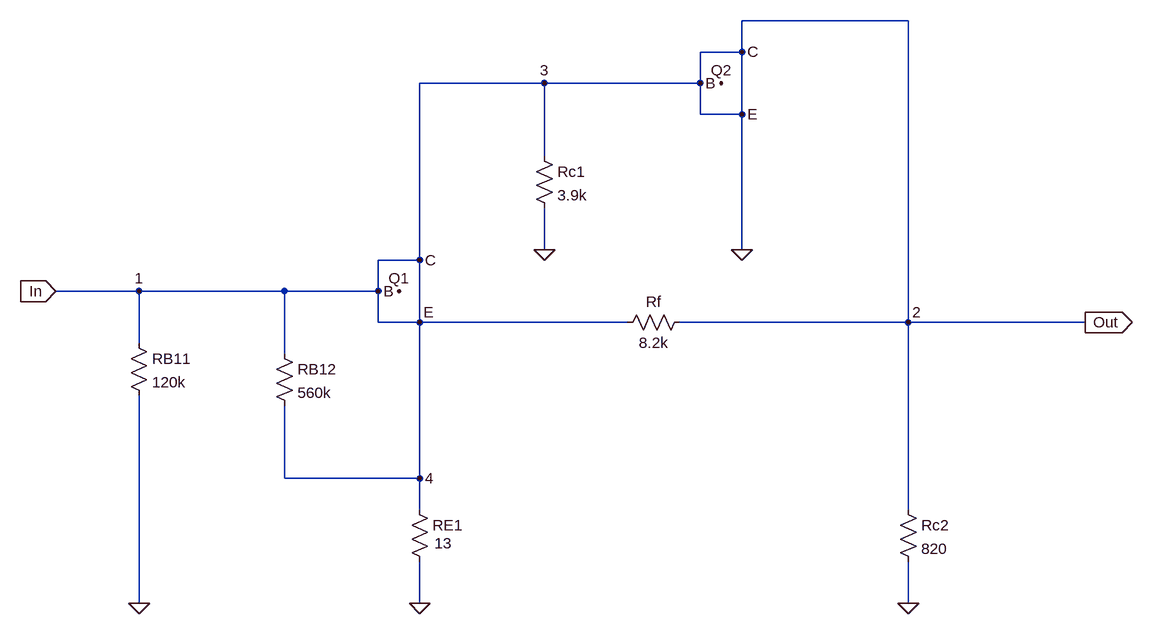
[diagram p0: schematic AC_equivalent_circuit.asc]
AC_equivalent_circuit.asc, the LTspice schematic file:
Version 4
SHEET 1 1652 680
WIRE 1280 -352 1024 -352
WIRE 1024 -304 1024 -352
WIRE 1024 -304 960 -304
WIRE 720 -256 528 -256
WIRE 960 -256 960 -304
WIRE 960 -256 720 -256
WIRE 960 -208 960 -256
WIRE 1024 -208 1024 -304
WIRE 1024 -208 960 -208
WIRE 720 -144 720 -256
WIRE 720 0 720 -64
WIRE 1024 0 1024 -208
WIRE 528 16 528 -256
WIRE 528 16 464 16
WIRE 96 64 -32 64
WIRE 320 64 96 64
WIRE 464 64 464 16
WIRE 464 64 320 64
WIRE 464 112 464 64
WIRE 528 112 528 16
WIRE 528 112 464 112
WIRE 848 112 528 112
WIRE 1280 112 1280 -352
WIRE 1280 112 928 112
WIRE 1552 112 1280 112
WIRE 96 144 96 64
WIRE 320 160 320 64
WIRE 320 352 320 240
WIRE 528 352 528 112
WIRE 528 352 320 352
WIRE 528 400 528 352
WIRE 1280 400 1280 112
WIRE 96 544 96 224
WIRE 528 544 528 480
WIRE 1280 544 1280 480
FLAG 1552 112 Out
IOPIN 1552 112 Out
FLAG -32 64 In
IOPIN -32 64 In
FLAG 96 64 1
FLAG 96 544 0
FLAG 1280 544 0
FLAG 720 0 0
FLAG 528 544 0
FLAG 1280 112 2
FLAG 720 -256 3
FLAG 528 352 4
FLAG 1024 0 0
FLAG 496 64 Q1
FLAG 992 -256 Q2
FLAG 528 16 C
FLAG 1024 -304 C
FLAG 464 64 B
FLAG 960 -256 B
FLAG 528 112 E
FLAG 1024 -208 E
SYMBOL res 80 128 R0
SYMATTR InstName RB11
SYMATTR Value 120k
SYMBOL res 304 144 R0
SYMATTR InstName RB12
SYMATTR Value 560k
SYMBOL res 512 384 R0
WINDOW 3 39 68 Left 2
SYMATTR Value 13
SYMATTR InstName RE1
SYMBOL res 944 96 R90
WINDOW 0 0 56 VBottom 2
WINDOW 3 32 56 VTop 2
SYMATTR InstName Rf
SYMATTR Value 8.2k
SYMBOL res 1264 384 R0
SYMATTR InstName Rc2
SYMATTR Value 820
SYMBOL res 704 -160 R0
SYMATTR InstName Rc1
SYMATTR Value 3.9k

The netlist it stands for:
* AC_equivalent_circuit.asc
RB11 0 0 120k
RB12 0 0 560k
RE1 0 0 13
Rf 0 0 8.2k
Rc2 0 0 820
Rc1 0 0 3.9k
.backanno
.end